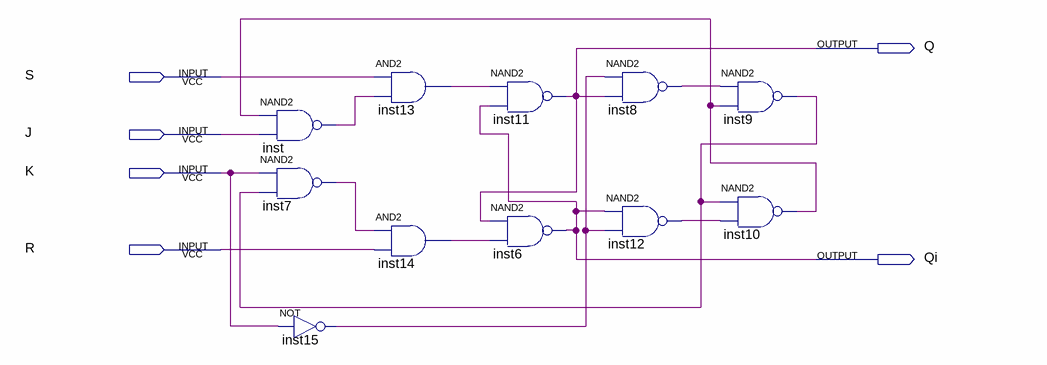
[diagram p0: schematic sheet]
// Quartus schematic JK_RS_sch.bdf as structural Verilog: 11 symbols, 6 pins
module JK_RS_sch (
  input  S,
  input  J,
  input  K,
  input  R,
  output Q,
  output Qi
);

  wire inst7_out, inst8_out, inst9_out, inst10_out, inst12_out, inst13_out, inst14_out, inst15_out, inst_out;

  nand inst (inst_out, inst10_out, J);
  nand inst7 (inst7_out, K, inst9_out);
  not inst15 (inst15_out, K);
  and inst13 (inst13_out, S, inst_out);
  and inst14 (inst14_out, inst7_out, R);
  nand inst11 (Q, inst13_out, Qi);
  nand inst6 (Qi, Q, inst14_out);
  nand inst8 (inst8_out, inst15_out, Q);
  nand inst12 (inst12_out, Qi, inst15_out);
  nand inst9 (inst9_out, inst8_out, inst10_out);
  nand inst10 (inst10_out, inst9_out, inst12_out);
endmodule
